# Altium schematic sheet 电机电源输入原理图.SchDoc
size A4
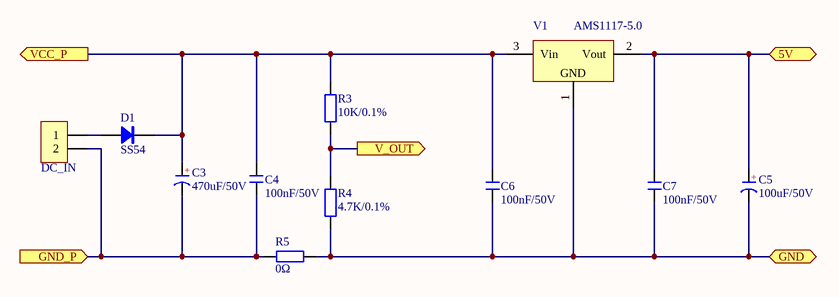
[diagram p0: 电机电源输入原理图.SchDoc]

## Parts
C3  470uF/50V  [CAP 5.0*12.5*20]
C4  100nF/50V  [C 0603_M]
C5  100uF/50V  [CAP 3.5*8*11.5]
C6  100nF/50V  [C 0603_M]
C7  100nF/50V  [C 0603_M]
D1  SS54  [SMA]
DC_IN  HDR-1X2  [XT30PW-M公头]  (value not drawn)
R3  10K/0.1%  [R 0603_M]
R4  4.7K/0.1%  [R 0603_M]
R5  0Ω  [R 0805_M]
V1  AMS1117-5.0  [SOT89_N]

## Ports
5V (bidir), GND (bidir), GND_P (in), V_OUT (out), VCC_P (out)

## Nets
5V: C5.1(A) C7.2 V1.2(Vout) ; port 5V
GND: C5.2(K) C6.1 C7.1 R4.1 R5.1 V1.1(GND) ; port GND
GND_P: C3.2(K) C4.1 DC_IN.2 R5.2 ; port GND_P
V_OUT: R3.1 R4.2 ; port V_OUT
VCC_P: C3.1(A) C4.2 C6.2 D1.2(K) R3.2 V1.3(Vin) ; port VCC_P
NetD1_1: D1.1(A) DC_IN.1

## Notes on the sheet
- (in symbol C-CAP) +

## Library data of the parts
C3 C5 = C-CAP: 直插电解电容; 版权归属: 源创客; BOM名称: 直插电解电容; 学习资源: www.ooocke.com
C4 C6 C7 = C: 无极性贴片电容; 版权归属: 源创客; 材质: X7R; BOM名称: 无极性贴片电容; 学习资源: www.ooocke.com
D1 = SS24: 肖特基二极管; 版权归属: 源创客; 属性: 40V/2A; BOM名称: 肖特基二极管; 学习资源: www.ooocke.com
DC_IN = Header 2: 2P接插件; 版权归属: 源创客; BOM名称: 2P接插件; 学习资源: www.ooocke.com
R3-R5 = R: 贴片电阻; 版权归属: 源创客; BOM名称: 贴片电阻; 学习资源: www.ooocke.com
V1 = AMS1117: 三端稳压芯片; BOM名称: 稳压芯片; 版权归属: 源创客; 学习资源: www.ooocke.com